# EAGLE design BeatleBeat (EAGLE 9.2.0)
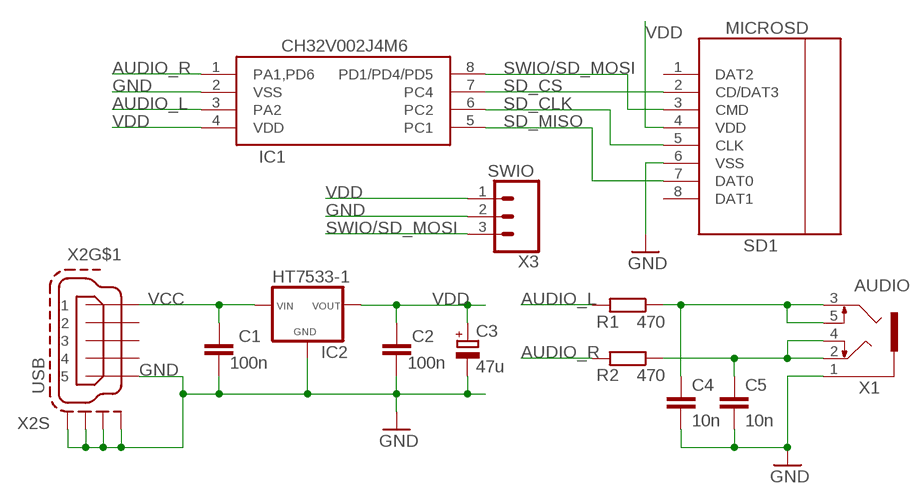
[diagram p0: schematic, sheet 1]

## Parts
C1  100n  C-EUC1206K  [C1206K]
C2  100n  C-EUC1206K  [C1206K]
C3  47u  CPOL-EUC/6032-28R  [C/6032-28R]
C4  10n  C-EUC1206K  [C1206K]
C5  10n  C-EUC1206K  [C1206K]
IC1  CH32V002J4M6  CH32V003J4M6  [SOP8]
IC2  HT7533-1  [HT7533-1]
R1  470  R-EU_M1206  [M1206]
R2  470  R-EU_M1206  [M1206]
SD1  MICROSD  [MICROSD]
X1  AUDIO  1503_09  [1503_09]
X2  USB  MINI-USB-SCHIELD-32005-201  [32005-201]
X3  SWIO  CONN_03LONGPADS  [1X03_LONGPADS]

## Nets
AUDIO_L: IC1.3(PA2) R1.2
AUDIO_R: IC1.1(PA1,PD6) R2.2
GND: C1.2 C2.2 C3.- C4.2 C5.2 IC1.2(VSS) IC2.GND SD1.6(VSS) X1.1 X2.5 X2.M1(S:S1) X2.M2(S:S2) X2.M3(S:S3) X2.M4(S:S4) X3.2
N$2: C4.1 R1.1 X1.3 X1.5
N$5: C5.1 R2.1 X1.2 X1.4
SD_CLK: IC1.6(PC2) SD1.5(CLK)
SD_CS: IC1.7(PC4) SD1.2(CD/DAT3)
SD_MISO: IC1.5(PC1) SD1.7(DAT0)
SWIO/SD_MOSI: IC1.8(PD1/PD4/PD5) SD1.3(CMD) X3.3
VCC: C1.1 IC2.VIN X2.1
VDD: C2.1 C3.+ IC1.4(VDD) IC2.VOUT SD1.4(VDD) X3.1
Unconnected: SD1.1(DAT2) SD1.8(DAT1) X2.2 X2.3 X2.4

## Library data of the parts
C1 C2 C4 C5 = rcl:C-EU: CAPACITOR, European symbol; SPICEPREFIX: C
C3 = rcl:CPOL-EU: POLARIZED CAPACITOR, European symbol; SPICEPREFIX: C
IC1 = CH32V:CH32V003J4M6
IC2 = HT7533-1B:HT7533-1
R1 R2 = rcl:R-EU_: RESISTOR, European symbol; SPICEPREFIX: R
SD1 = Wuerth_Elektronik_eiCan_Communication_Connectors_v2.2:MICROSD: WR-CRD MICRO SD CARD CONNECTOR HINGE 8PINS
X1 = con-lumberg:1503_09: Jack connectors according to JISC 6560, 3.5 mm Klinkeneinbaukupplung nach JISC 6560, 3,5 mm, 3-polig/ stereo, abgewinkelte Ausführung, mit 2 Öffnern und Lötaugen, für Leiterplatten Rückseitenmontage Source: http://www.lumberg.com/Produkte/PDFs/1503_09.pdf; OC_FARNELL: 1243244; OC_NEWARK: unknown
X2 = con-cypressindustries:MINI-USB-SCHIELD-: MINI USB-B Conector Source: www.cypressindustries.com; OC_FARNELL: unknown; OC_NEWARK: unknown
X3 = SparkFun-Connectors:CONN_03: Multi connection point. Often used as Generic Header-pin footprint for 0.1 inch spaced/style header connections On any of the 0.1 inch spaced packages, you can populate with these: Break Away Headers - Straight <https://www.sparkfun.com/products/116> (PRT-00116) Break Away Male Headers - Right Angle <https://www.sparkfun.com/products/553> (PRT-00553) Female Headers <https://www.sparkfun.com/products/115> (PRT-00115) Break Away Headers - Machine Pin <https://www.sparkfun.com/products/117> (PRT-00117) Break Away Female Headers - Swiss Machine Pin <https://www.sparkfun.com/products/743> (PRT-00743) Stackable Header - 3 Pin (Female, 0.1") <https://www.sparkfun.com/products/13875> (PRT-13875) For SCREWTERMINALS and SPRING TERMINALS visit here: Screw Terimnals on SparkFun.com <https://www.sparkfun.com/search/results?term=Screw+Terminals> (5mm/3.5mm/2.54mm spacing) This device is also useful as a general connection point to wire up your design to another part of your project. Our various solder wires solder well into these plated through hole pads. Hook-Up Wire - Assortment (Stranded, 22 AWG) <https://www.sparkfun.com/products/11375> (PRT-11375) Hook-Up Wire - Assortment (Solid Core, 22 AWG) <https://www.sparkfun.com/products/11367> (PRT-11367) View the entire wire category on our website here <https://www.sparkfun.com/categories/141> Special notes: Molex polarized connector foot print use with SKU : PRT-08232 with associated crimp pins and housings.

## Board
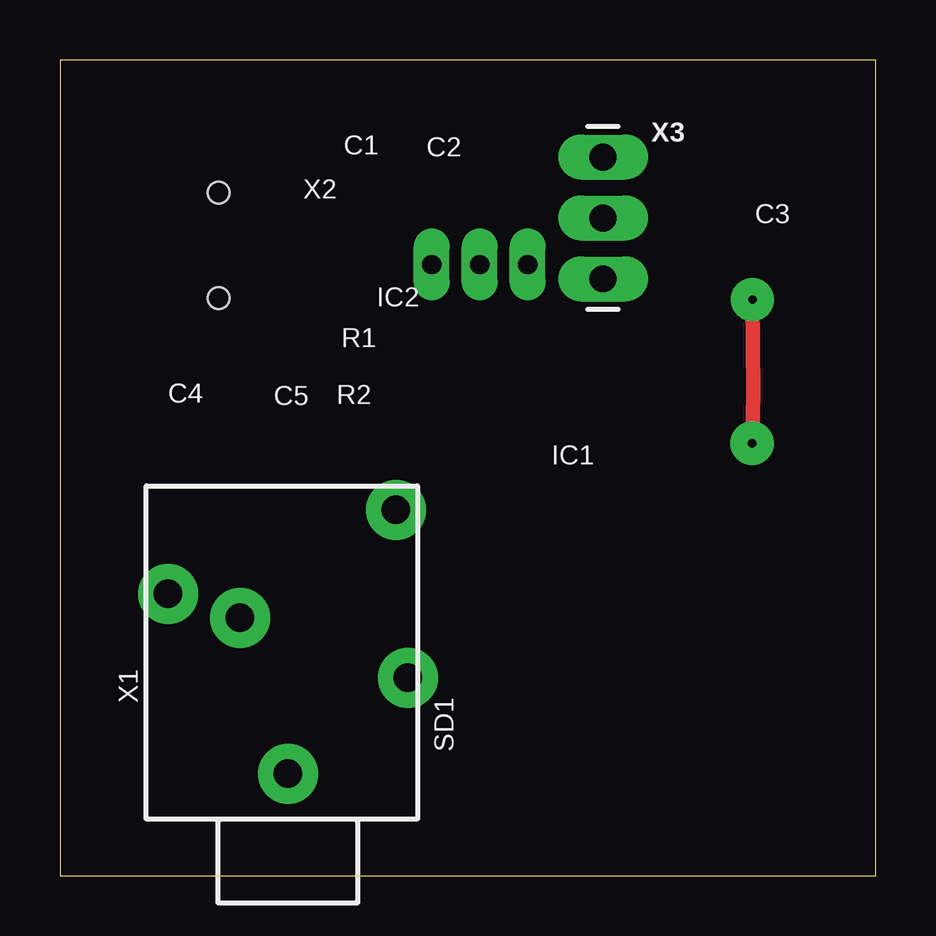
[diagram p1: board, top side]
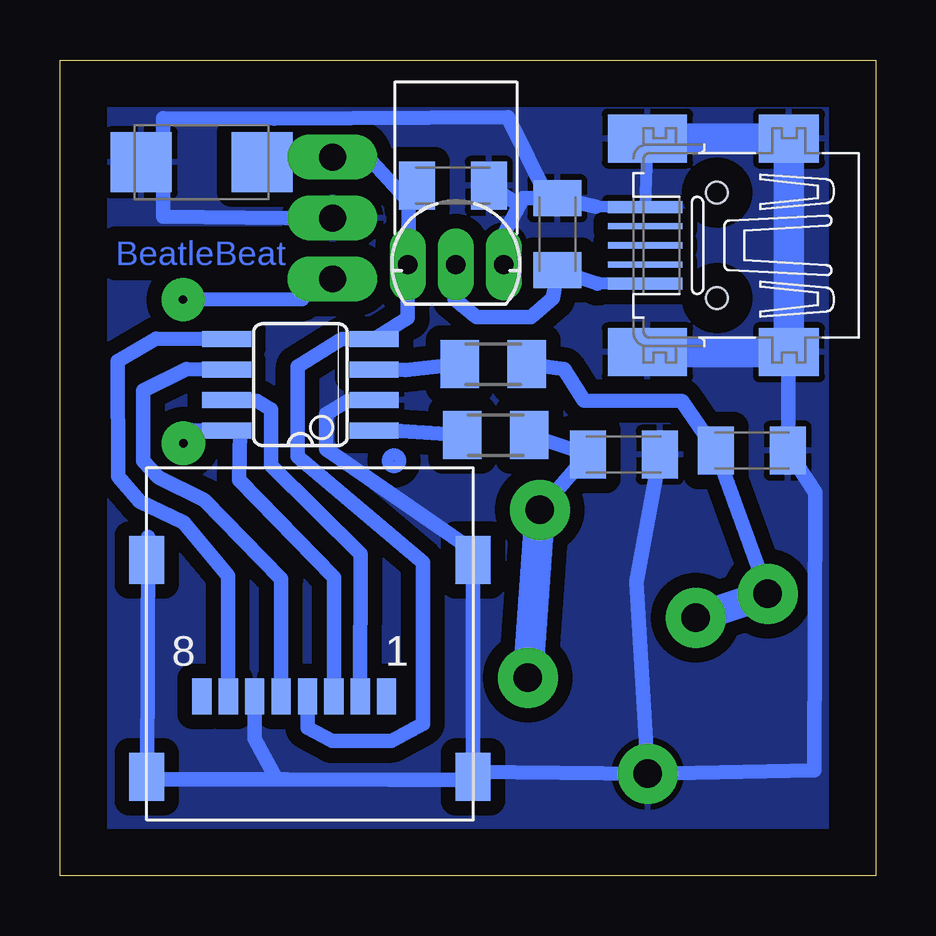
[diagram p2: board, bottom side, seen from below]

Size 34 x 34 mm. Coordinates in mm from the lower left corner, seen from the top.
Outline: 0,0 34,0 34,34 0,34 0,0
Copper layers (1*16): Top 0.035mm / dielectric 1.5mm / Bottom 0.035mm
Design rules "default": minimum track width 6mil, minimum drill 0.35mm, track to track 6mil, track to pad 6mil, pad to pad 6mil, via to via 6mil, smd to smd 6mil, copper to edge 40mil, drill to drill 6mil, minimum pad ring 10mil, minimum via ring 8mil, stop-mask expansion 4mil, vias tented up to drill 0mil, thermal gap 10mil

### Footprints (pad centres in the part's own frame; a part is rotated, then mirrored left to right if it is on the bottom)
C1206K = smd 1.5 x 2: 1 -1.5,0; 2 1.5,0
C/6032-28R = smd 2.55 x 2.5: + 2.525,0; - -2.525,0
SOP8 = smd 0.66 x 2.032: 1 -1.905,-3.073; 2 -0.635,-3.073; 3 0.635,-3.073; 4 1.905,-3.073; 5 1.905,3.073; 6 0.635,3.073; 7 -0.635,3.073; 8 -1.905,3.073
HT7533-1 = drill 0.8 pad 1.5 long: GND 2,0; VIN 0,0; VOUT -2,0
M1206 = smd 1.6 x 2: 1 -1.4,0; 2 1.4,0
MICROSD = smd 0.8 x 1.5: 1 2.62,-2.54; 2 1.52,-2.54; 3 0.42,-2.54; 4 -0.68,-2.54; 5 -1.78,-2.54; 6 -2.88,-2.54; 7 -3.98,-2.54; 8 -5.08,-2.54 | smd 1.45 x 2: Z1 -7.38,3.16; Z2 6.22,3.16; Z3 -7.38,-5.89; Z4 6.22,-5.89
1503_09 = drill 1.2 pad 2.5: 1 0,-2; 2 -5,-6; 3 5,-9.5; 4 -4.5,-13; 5 2,-8.5
32005-201 = smd 3.1 x 0.5: 1 3,1.6; 5 3,-1.6 | smd 3.1 x 0.254: 2 3,0.8; 3 3,0; 4 3,-0.8 | smd 2.5 x 2: M1 -3,-4.45; M2 -3,4.45 | smd 3.3 x 2: M3 2.9,4.45; M4 2.9,-4.45 | hole 0.9: 0,2.2; 0,-2.2
1X03_LONGPADS = drill 1.118 pad 1.88 long: 1 0,0; 2 2.54,0; 3 5.08,0

### Placement (x,y rotation side)
C1  13.26,26.73 90 bottom
C2  17.62,28.76 0 bottom
C3  28.09,29.74 0 bottom
C4  5.16,17.71 0 bottom
C5  10.5,17.55 0 bottom
IC1  23.98,20.46 90 bottom
IC2  17.5,25.47 0 bottom
R1  15.94,21.31 180 bottom
R2  15.83,18.36 180 bottom
SD1  23,10 0 bottom
X1  9.5,2.25 180 top
X2  6.61,26.27 180 bottom
X3  22.64,29.95 270 top

### Tracks (layer width: path | path; a pad name or v marks a point on that pad's centre or on a via)
AUDIO_L
  Bottom 0.61: IC1.3 19.6,21.07 R1.2
AUDIO_R
  Bottom 0.61: IC1.1 19.79,18.52 R2.2
GND
  Bottom 0.508: X2.M4 X2.5 11.65,27.88
  Bottom 0.61: SD1.6 25.89,5.69 24.96,4.01 24.53,4.01 | 24.53,4.01 20.26,3.99 16.99,4 | 16.99,4 16.78,4.06 16.78,13.56 22.9,17.78 22.9,19.24 22,19.79 IC1.2 | C5.2 9.97,12.23 X1.1 | X1.1 16.83,4.33 16.99,4 | X1.1 2.55,4.39 2.5,15.97 C4.2 X2.M2 | 11.65,27.88 C1.2 13.65,28.23 | 13.65,28.23 14.7,28.23 14.85,27.95 | 14.85,27.95 15.45,26.82 IC2.GND | X3.2 24.57,27.41 29.7,27.46 29.7,29.77 | 29.7,29.77 29.7,31.57 25.07,31.56 15.33,31.61 13.65,28.23 | C2.2 14.85,27.95 | 24.53,4.01 30.37,4.01 30.33,14.12 | C3.- 29.7,29.77
  Bottom 1.27: X2.M3 X2.M2 X2.M1 X2.M4
  pour Bottom (isolate 0.61): 2,2 2,32 32,32 32,2
N$2
  Bottom 0.61: R1.1 12.99,21.11 12.15,19.8 8.08,19.79 C4.1 X1.3
  Bottom 1.27: X1.3 X1.5
N$5
  Bottom 0.61: R2.1 C5.1 X1.4
  Bottom 1.27: X1.4 X1.2
SD_CLK
  Bottom 0.61: SD1.5 24.78,12.36 28,15.66 29.89,16.58 30.53,17.28 30.53,20.23 28.71,21.11 IC1.6
SD_CS
  Bottom 0.61: SD1.2 21.46,13.4 25.19,17.1 25.19,19.43 25.78,19.77 IC1.7
SD_MISO
  Bottom 0.61: SD1.7 26.99,12.48 28.85,14.71 30.67,15.59 31.57,16.64 31.59,21.44 29.99,22.38 IC1.5
SWIO/SD_MOSI  (via drill 0.35 pad 1.8)
  Top 0.61: v28.86,18.02 28.91,20.18 v28.87,24.01
  Bottom 0.61: SD1.3 22.57,12.44 26.54,16.48 26.49,18.54 IC1.8 28.54,18.57 v28.86,18.02 | v28.87,24.01 23.91,24.02 23.68,24.94 X3.3
VCC
  Bottom 0.508: X2.1 11.59,24.67
  Bottom 0.61: 11.59,24.67 C1.1 13.44,24.07 14.36,23.28 16.64,23.28 17.56,24.03 IC2.VIN
VDD
  Bottom 0.61: SD1.4 23.68,6.16 22.66,5.61 20.18,5.62 18.87,6.33 18.87,13.04 24.09,17.47 24.09,21.21 22.25,22.37 IC1.4 19.5,23.23 IC2.VOUT 19.48,28.11 19.86,28.53 | 19.86,28.53 21.01,29.78 X3.1 C3.+ | C2.1 19.86,28.53
(copper drawn outside any net)
  shapes: Bottom circle x1

### Text on the board
Bottom: BeatleBeat
Document: VCC